# Altium schematic sheet Microcontroller.SchDoc: Microcontroller and Peripherals
size 279 x 215 mm; Author: Riley Peterson; Revision: 0; SheetNumber: 2; SheetTotal: 4
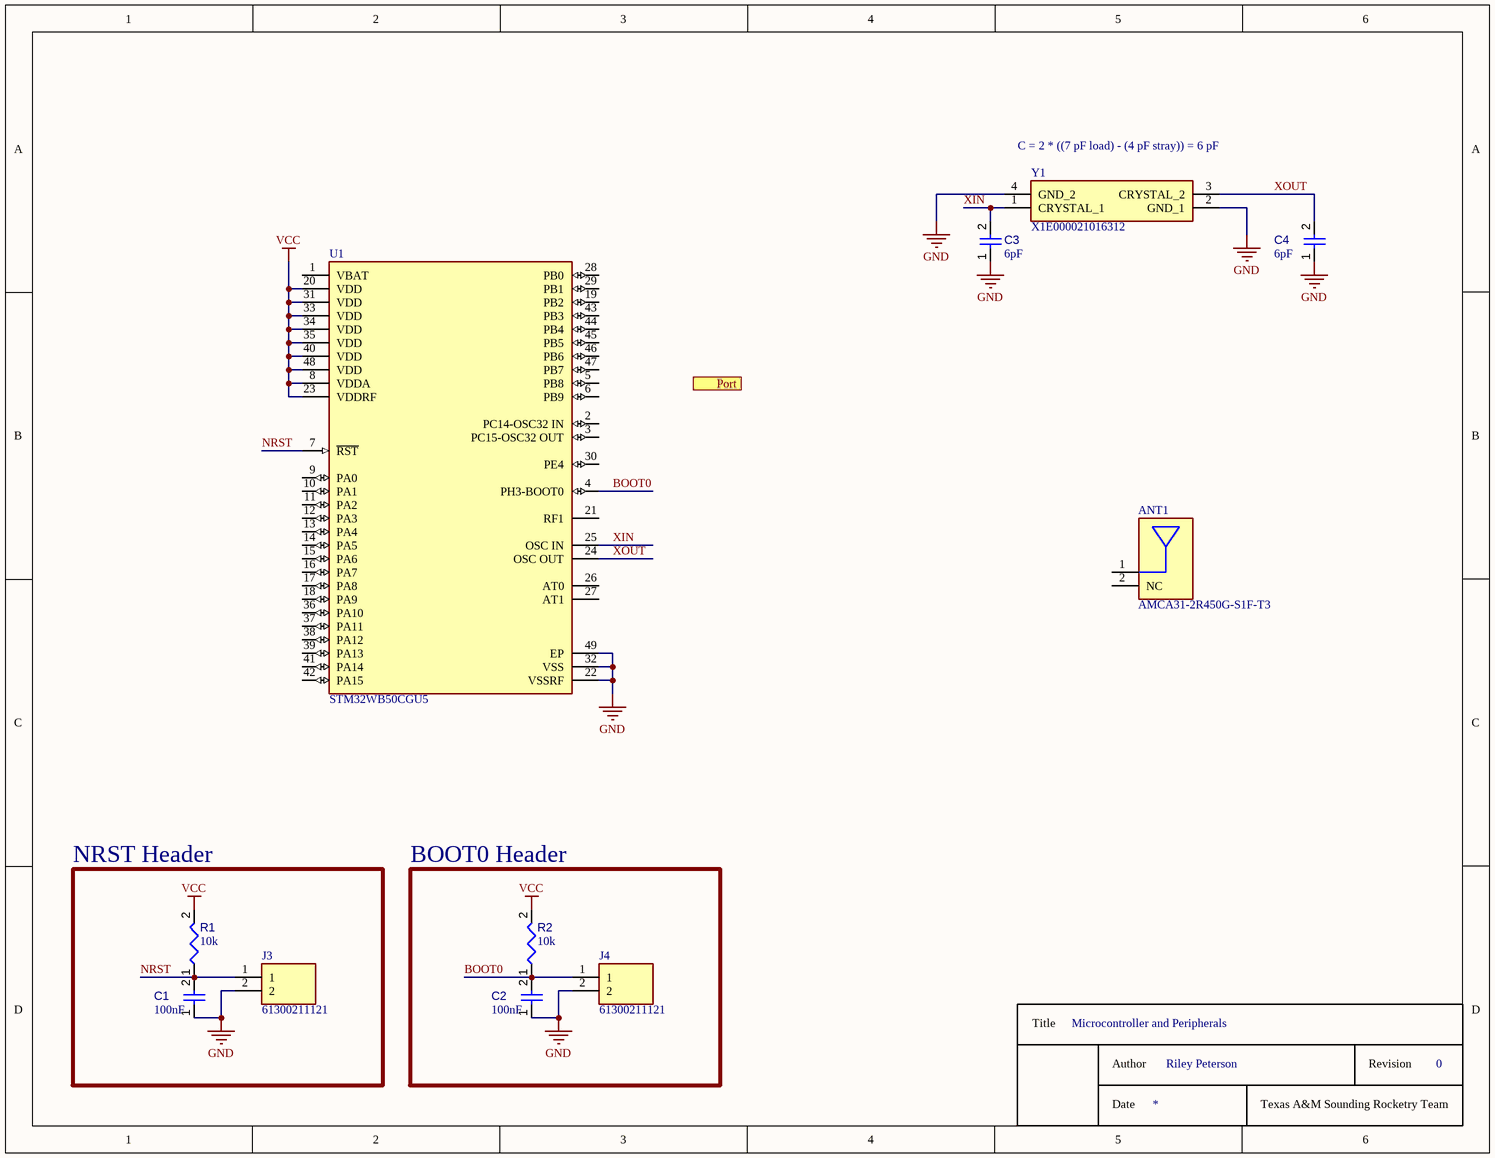
[diagram p0: Microcontroller.SchDoc]

## Parts
ANT1  AMCA31-2R450G-S1F-T3  [FP-AMCA31-MFG]
C1  value 100nF  [CAPC0603(1608)100_L]  (hidden comment: Capacitors,0603,smt,100nF)
C2  value 100nF  [CAPC0603(1608)100_L]  (hidden comment: Capacitors,0603,smt,100nF)
C3  value 6pF  [CAPC0603(1608)100_L]  (hidden comment: Capacitors,0603,smt,6pF)
C4  value 6pF  [CAPC0603(1608)100_L]  (hidden comment: Capacitors,0603,smt,6pF)
J3  61300211121  [HDRV2W110P0X254_1X2_508X254X854P]
J4  61300211121  [HDRV2W110P0X254_1X2_508X254X854P]
R1  value 10k  [RESC0603(1608)_L]  (hidden comment: Resistors,0603,smt,10k)
R2  value 10k  [RESC0603(1608)_L]  (hidden comment: Resistors,0603,smt,10k)
U1  STM32WB50CGU5  [FP-UFQFPN48-A0B9-MFG]
Y1  X1E000021016312  [X1E000021016312]

## Blocks framed on the sheet
NRST Header: C1 J3 R1
BOOT0 Header: C2 J4 R2

## Ports
Port

## Nets
GND: C1.1 C2.1 C3.1 C4.1 J3.2 J4.2 U1.22(VSSRF) U1.32(VSS) U1.49(EP) Y1.2(GND_1) Y1.4(GND_2)
VCC: R1.2 R2.2 U1.8(VDDA) U1.20(VDD) U1.23(VDDRF) U1.31(VDD) U1.33(VDD) U1.34(VDD) U1.35(VDD) U1.40(VDD) U1.48(VDD)
BOOT0: C2.2 J4.1 R2.1 U1.4(PH3-BOOT0)
NRST: C1.2 J3.1 R1.1 U1.7(~{RST})
XIN: C3.2 U1.25(OSC_IN) Y1.1(CRYSTAL_1)
XOUT: C4.2 U1.24(OSC_OUT) Y1.3(CRYSTAL_2)

Not connected (* = marked no-connect by the designer): ANT1 1(Feed_Point) 2(NC); U1 1(VBAT) 2(PC14-OSC32_IN) 3(PC15-OSC32_OUT) 5(PB8) 6(PB9) 9(PA0) 10(PA1) 11(PA2) 12(PA3) 13(PA4) 14(PA5) 15(PA6) 16(PA7) 17(PA8) 18(PA9) 19(PB2) 21(RF1) 26(AT0) 27(AT1) 28(PB0) 29(PB1) 30(PE4) 36(PA10) 37(PA11) 38(PA12) 39(PA13) 41(PA14) 42(PA15) 43(PB3) 44(PB4) 45(PB5) 46(PB6) 47(PB7)

## Notes on the sheet
- (near Y1) C = 2 * ((7 pF load) - (4 pF stray)) = 6 pF
- Title
- Author
- Date
- Texas A&M Sounding Rocketry Team
- Revision

## Library data of the parts
ANT1 = CMP-27836-000002-1: RF ANT 2.4GHZ CHIP SOLDER SMD; Manufacturer: Abracon; Power Rating: 3W; Max Frequency: 2450MHz; Impedance: 50Ω; Number Of Bands: 1; Bandwidth: 100MHz; RoHS: TRUE; ComponentLink2Description: Datasheet; Category: Ant; Temperature: -40°C to +85°C; Device Class L3: RF Antennas; Octopart: https://octopart.com/amca31-2r450g-s1f-t3-abracon-31435383; Manufacturer Part Number: AMCA31-2R450G-S1F-T3; Digikey Description: RF ANT 2.4GHZ CHIP SOLDER SMD; Package: AMCA31; Temperature Range High: +85°C; Automotive: No; Device Class L2: RF Semiconductors and Devices; ComponentLink2URL: https://abracon.com/chip-antenna/AMCA31-2R450G-S1F-T3.pdf; Temperature Range Low: -40°C; Device Class L1: Integrated Circuits (ICs); Lead Free: Yes; Height: 1.4mm; Mouser Description: Antennas 2.45GHz BW 90dB + Gain -1 dBi avg.
C1-C4 = Capacitors: Capacitor; Mounting Technology: smt; Case/Package: 0603; Component Type: Capacitors
J3 J4 = 61300211121: Connector; Manufacturer_Name: Wurth Elektronik; Datasheet Link: https://componentsearchengine.com/Datasheets/2/61300211121.pdf; Height: 8.54mm; Manufacturer_Part_Number: 61300211121; Mouser Part Number: 710-61300211121; Mouser Price/Stock: https://www.mouser.co.uk/ProductDetail/Wurth-Elektronik/61300211121?qs=t4813l51qx%252B1A5GYDQxPlw%3D%3D
R1 R2 = Resistors: Resistor; Mounting Technology: smt; Case/Package: 0603; Component Type: Resistors
U1 = CMP-12105-000070-1.A.2: ULTRA-LOW-POWER DUAL CORE ARM CO; Manufacturer: STMicroelectronics; Core Architecture: ARM Cortex-M4; Max Supply Voltage: 3.6V; Ram Size: 128KBytes; Number Of Timers/Counters: 7; Number Of Adc Channels: 10; Number Of Uart Channels: 1; Min Supply Voltage: 2V; Max Junction Temp: +105°C; Number Of Cores: 2; Standoff Height: 0mm; Interface: I2C,SPI,UART,USART,SMBus,Other; Memory Size: 1MBytes; Number Of I/Os: 30; Memory Type: FLASH; Frequency: 64MHz; Data Bus Width: 32bits; ComponentLink2URL: https://www.st.com/resource/en/datasheet/stm32wb50cg.pdf; Temperature Range High: +105°C; Package: UFQFPN48-A0B9; Automotive: No; Ambient Temperature Range High: +85°C; Octopart: https://octopart.com/stm32wb50cgu5-stmicroelectronics-106131324; Device Class L2: Embedded Processors and Controllers; Category: IC; Manufacturer Part Number: STM32WB50CGU5; Height: 0.65mm; Number Of A/D Converters: 1; Temperature: -10°C to +105°C; Lead Free: Yes; Number Of Spi Channels: 1; Device Class L3: Microcontrollers; Temperature Range Low: -10°C; RoHS: TRUE; Ambient Temperature Range Low: -10°C; Digikey Description: ULTRA-LOW-POWER DUAL CORE ARM CO; Number Of I2C Channels: 1; Device Class L1: Integrated Circuits (ICs); ComponentLink2Description: Datasheet
Y1 = X1E000021016312: Crystal or Oscillator; Manufacturer_Name: Epson Timing; Height: 0.6mm; Manufacturer_Part_Number: X1E000021016312